# EAGLE design music-lights (EAGLE 9.6.1)
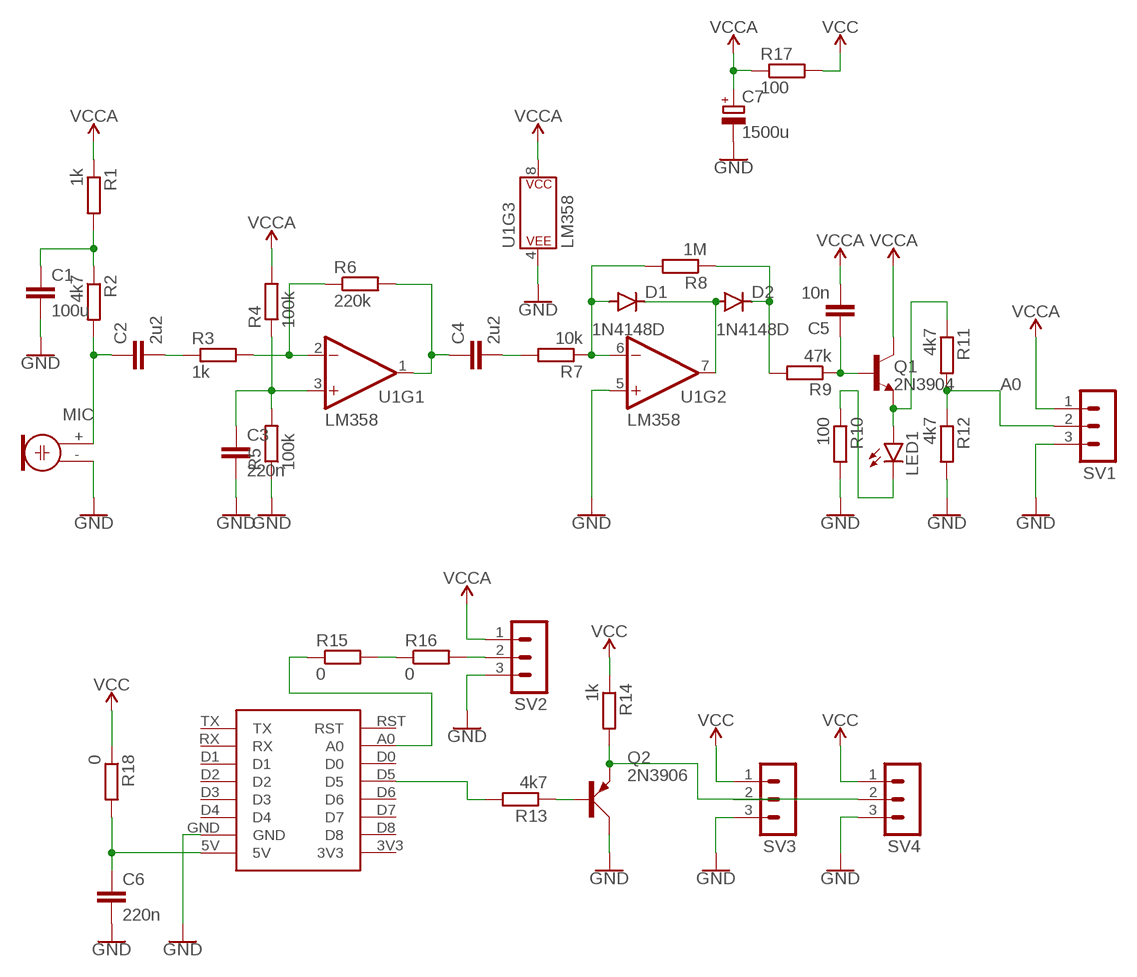
[diagram p0: schematic, sheet 1]

## Parts
C1  100u  C-EU050-024X044  [C050-024X044]
C2  2u2  C-EU050-024X044  [C050-024X044]
C3  220n  C-EU050-024X044  [C050-024X044]
C4  2u2  C-EU050-024X044  [C050-024X044]
C5  10n  C-EU050-024X044  [C050-024X044]
C6  220n  C-EU050-024X044  [C050-024X044]
C7  1500u  CPOL-EUTT5D7L  [TT5D7L]
D1  1N4148D  1N4148DO35-7  [DO35-7]
D2  1N4148D  1N4148DO35-7  [DO35-7]
LED1  LED5MM  [LED5MM]
MIC  ELECTRET  [9.7ELECTRET]
Q1  2N3904  [TO92]
Q2  2N3906  [TO92D]
R1  1k  R-EU_0207/7  [0207/7]
R2  4k7  R-EU_0207/7  [0207/7]
R3  1k  R-EU_0207/7  [0207/7]
R4  100k  R-EU_0207/7  [0207/7]
R5  100k  R-EU_0207/7  [0207/7]
R6  220k  R-EU_0207/7  [0207/7]
R7  10k  R-EU_0207/7  [0207/7]
R8  1M  R-EU_0207/7  [0207/7]
R9  47k  R-EU_0207/7  [0207/7]
R10  100  R-EU_0207/7  [0207/7]
R11  4k7  R-EU_0207/7  [0207/7]
R12  4k7  R-EU_0207/7  [0207/7]
R13  4k7  R-EU_0207/7  [0207/7]
R14  1k  R-EU_0207/7  [0207/7]
R15  0  R-EU_0207/7  [0207/7]
R16  0  R-EU_0207/7  [0207/7]
R17  100  R-EU_0207/7  [0207/7]
R18  0  R-EU_0207/7  [0207/7]
SV1  MA03-1  [MA03-1]
SV2  MA03-1  [MA03-1]
SV3  MA03-1  [MA03-1]
SV4  MA03-1  [MA03-1]
U1  LM358  LM358KIT  [DIP08-KIT]
U$1  8266MINI  [8266MINI]

## Nets
A0: R11.2 R12.1 SV1.2
GND: C1.2 C3.2 C6.2 C7.- MIC.- Q2.C R5.1 R10.2 R12.2 SV1.3 SV2.3 SV3.3 SV4.3 U1.4(P$V-) U1.5(+IN) U$1.GND
N$1: R13.2 U$1.D5
N$2: Q2.B R13.1
N$3: C2.1 MIC.+ R2.2
N$4: C1.1 R1.2 R2.1
N$5: C2.2 R3.1
N$6: C3.1 R4.1 R5.2 U1.3(+IN)
N$7: R3.2 R6.1 U1.2(-IN)
N$8: C4.1 R6.2 U1.1(OUT)
N$9: C4.2 R7.2
N$10: D1.C D2.A U1.7(OUT)
N$11: D1.A R7.1 R8.2 U1.6(-IN)
N$12: D2.C R8.1 R9.2
N$13: C5.1 Q1.2(B) R9.1
N$14: LED1.K(C) R10.1
N$15: LED1.A Q1.3(E) R11.1
N$16: Q2.E R14.2 SV3.2 SV4.2
N$17: R16.2 SV2.2
N$18: R15.1 U$1.A0
N$19: R15.2 R16.1
N$21: C6.1 R18.2 U$1.5V
VCC: R14.1 R17.2 R18.1 SV3.1 SV4.1
VCCA: C5.2 C7.+ Q1.1(C) R1.1 R4.2 R17.1 SV1.1 SV2.1 U1.8(P$V+)
Unconnected: U$1.3V3 U$1.D0 U$1.D1 U$1.D2 U$1.D3 U$1.D4 U$1.D6 U$1.D7 U$1.D8 U$1.RST U$1.RX U$1.TX

## Library data of the parts
C1-C6 = rcl:C-EU: CAPACITOR, European symbol; SPICEPREFIX: C
C7 = rcl:CPOL-EU: POLARIZED CAPACITOR, European symbol; SPICEPREFIX: C
D1 D2 = diode:1N4148: DIODE high speed (Philips)
LED1 = led:LED: LED OSRAM: - CHIPLED LG R971, LG N971, LY N971, LG Q971, LY Q971, LO R971, LY R971 LH N974, LH R974 LS Q976, LO Q976, LY Q976 LO Q996 - Hyper CHIPLED LW Q18S LB Q993, LB Q99A, LB R99A - SideLED LS A670, LO A670, LY A670, LG A670, LP A670 LB A673, LV A673, LT A673, LW A673 LH A674 LY A675 LS A676, LA A676, LO A676, LY A676, LW A676 LS A679, LY A679, LG A679 - Hyper Micro SIDELED® LS Y876, LA Y876, LO Y876, LY Y876 LT Y87S - SmartLED LW L88C, LW L88S LB L89C, LB L89S, LG L890 LS L89K, LO L89K, LY L89K LS L896, LA L896, LO L896, LY L896 - TOPLED LS T670, LO T670, LY T670, LG T670, LP T670 LSG T670, LSP T670, LSY T670, LOP T670, LYG T670 LG T671, LOG T671, LSG T671 LB T673, LV T673, LT T673, LW T673 LH T674 LS T676, LA T676, LO T676, LY T676, LB T676, LH T676, LSB T676, LW T676 LB T67C, LV T67C, LT T67C, LS T67K, LO T67K, LY T67K, LW E67C LS E67B, LA E67B, LO E67B, LY E67B, LB E67C, LV E67C, LT E67C LW T67C LS T679, LY T679, LG T679 LS T770, LO T770, LY T770, LG T770, LP T770 LB T773, LV T773, LT T773, LW T773 LH T774 LS E675, LA E675, LY E675, LS T675 LS T776, LA T776, LO T776, LY T776, LB T776 LHGB T686 LT T68C, LB T68C - Hyper Mini TOPLED® LB M676 - Mini TOPLED Santana® LG M470 LS M47K, LO M47K, LY M47K Source: http://www.osram.convergy.de LUXEON: - LUMILED® LXK2-PW12-R00, LXK2-PW12-S00, LXK2-PW14-U00, LXK2-PW14-V00 LXK2-PM12-R00, LXK2-PM12-S00, LXK2-PM14-U00 LXK2-PE12-Q00, LXK2-PE12-R00, LXK2-PE12-S00, LXK2-PE14-T00, LXK2-PE14-U00 LXK2-PB12-K00, LXK2-PB12-L00, LXK2-PB12-M00, LXK2-PB14-N00, LXK2-PB14-P00, LXK2-PB14-Q00 LXK2-PR12-L00, LXK2-PR12-M00, LXK2-PR14-Q00, LXK2-PR14-R00 LXK2-PD12-Q00, LXK2-PD12-R00, LXK2-PD12-S00 LXK2-PH12-R00, LXK2-PH12-S00 LXK2-PL12-P00, LXK2-PL12-Q00, LXK2-PL12-R00 Source: www.luxeon.com KINGBRIGHT: KA-3528ASYC Source: www.kingbright.com
MIC = adafruit:ELECTRET: Electret microphone Thru hole 2.54mm spacing with 9.7mm diameter
Q1 = transistor:2N3904: NPN TRANSISTOR
Q2 = transistor-small-signal:2N3906: PNP TRANSISTOR
R1-R18 = rcl:R-EU_: RESISTOR, European symbol; SPICEPREFIX: R
SV1-SV4 = con-lstb:MA03-1: PIN HEADER; OC_FARNELL: unknown; OC_NEWARK: unknown
U1 = SparkFun-IC-Amplifiers:LM358: LM358 Jellybean op-amp Datasheet <http://www.sparkfun.com/datasheets/Components/General/LM358.pdf> SparkFun Products Op-Amp (Thru-Hole) - LM358 <https://www.sparkfun.com/products/9456> (COM-09456); PROD_ID: IC-09172
U$1 = chinese-modules:8266MINI: ESP8266 WeMos D1 Mini

## Board
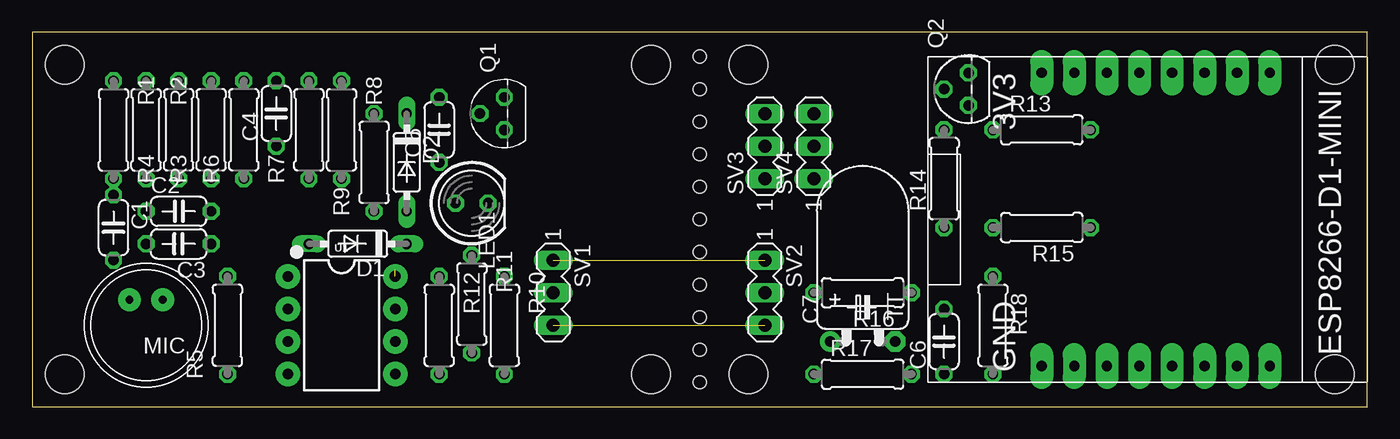
[diagram p1: board, top side]
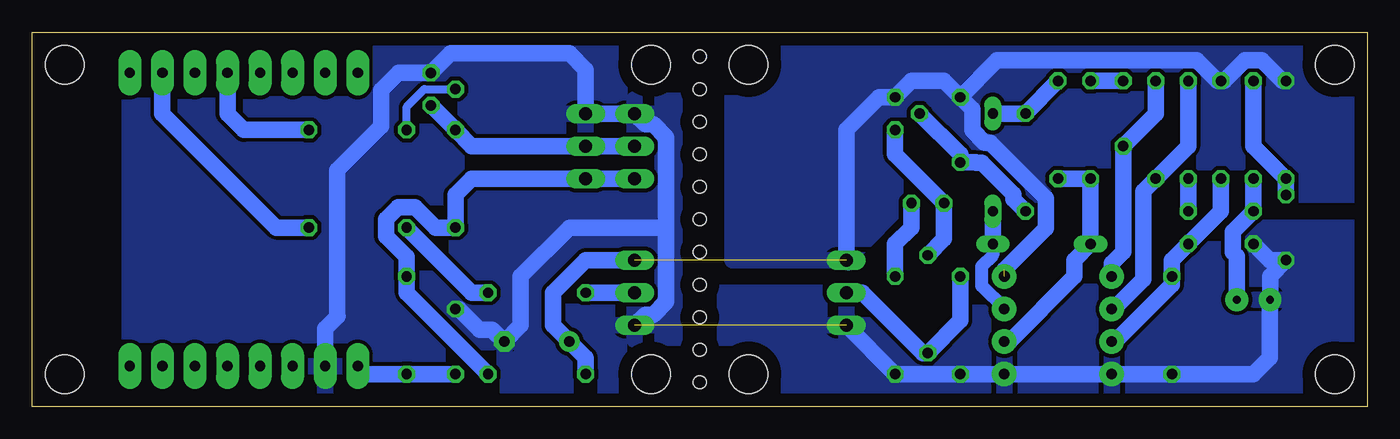
[diagram p2: board, bottom side, seen from below]

Size 104.14 x 29.21 mm. Coordinates in mm from the lower left corner, seen from the top.
Outline: 0,0 104.14,0 104.14,29.21 0,29.21 0,0
Copper layers (1*16): Top 0.035mm / dielectric 1.5mm / Bottom 0.035mm
Design rules "default *": minimum track width 6mil, minimum drill 0.35mm, track to track 12mil, track to pad 12mil, pad to pad 12mil, via to via 12mil, smd to smd 12mil, copper to edge 40mil, drill to drill 6mil, minimum pad ring 10mil, minimum via ring 8mil, stop-mask expansion 4mil, vias tented up to drill 0mil, thermal gap 10mil
Holes 3 mm at 48.26,2.54 48.26,26.67 2.54,26.67 2.54,2.54 101.6,2.54 55.88,2.54 55.88,26.67 101.6,26.67
Holes 1 mm at 52.07,27.3 52.07,24.77 52.07,22.23 52.07,19.68 52.07,17.14 52.07,14.61 52.07,12.06 52.07,9.53 52.07,6.99 52.07,4.45 52.07,1.91

### Footprints (pad centres in the part's own frame; a part is rotated, then mirrored left to right if it is on the bottom)
C050-024X044 = drill 0.813 octagon: 1 -2.54,0; 2 2.54,0
TT5D7L = drill 0.813 pad 1.6: + -2.54,0 | drill 0.813 pad 1.6 octagon: - 2.54,0
DO35-7 = drill 0.813 long: A 3.81,0; C -3.81,0
LED5MM = drill 0.813 octagon: A -1.27,0; K 1.27,0
9.7ELECTRET = drill 0.6 pad 1.778: + 1.3,2; - -1.3,2
TO92 = drill 0.813 octagon: 1 1.27,0; 2 0,1.905; 3 -1.27,0
TO92D = drill 0.813 octagon: B 0,1.905; C 1.27,0; E -1.27,0
0207/7 = drill 0.813 octagon: 1 -3.81,0; 2 3.81,0
MA03-1 = drill 1.016 long: 1 -2.54,0; 2 0,0; 3 2.54,0
DIP08-KIT = drill 0.813 pad 1.905: 1 -3.81,-4.191; 2 -1.27,-4.191; 3 1.27,-4.191; 4 3.81,-4.191; 5 3.81,4.191; 6 1.27,4.191; 7 -1.27,4.191 | drill 0.864 pad 1.905: 8 -3.81,4.191
8266MINI = drill 0.8 pad 1.778 long: 3V3 1.27,8.89; 5V 24.13,8.89; A0 1.27,24.13; D0 1.27,21.59; D1 24.13,21.59; D2 24.13,19.05; D3 24.13,16.51; D4 24.13,13.97; D5 1.27,19.05; D6 1.27,16.51; D7 1.27,13.97; D8 1.27,11.43; GND 24.13,11.43; RST 1.27,26.67; RX 24.13,24.13; TX 24.13,26.67

### Placement (x,y rotation side)
C1  6.35,13.97 270 top
C2  11.43,15.24 0 top
C3  11.43,12.7 180 top
C4  19.05,22.86 90 top
C5  31.75,21.59 90 top
C6  71.12,5.08 90 top
C7  64.77,5.08 0 top
D1  25.4,12.7 180 top
D2  29.21,19.05 270 top
LED1  34.29,15.88 0 top
MIC  8.89,6.35 0 top
Q1  36.83,22.86 90 top
Q2  73.03,24.77 90 top
R1  6.35,21.59 270 top
R2  8.89,21.59 270 top
R3  13.97,21.59 90 top
R4  11.43,21.59 90 top
R5  15.24,6.35 90 top
R6  16.51,21.59 90 top
R7  21.59,21.59 90 top
R8  24.13,21.59 270 top
R9  26.67,19.05 90 top
R10  36.83,6.35 270 top
R11  34.29,8 270 top
R12  31.75,6.35 270 top
R13  78.74,21.59 0 top
R14  71.12,17.78 90 top
R15  78.74,13.97 180 top
R16  64.77,8.89 180 top
R17  64.77,2.54 0 top
R18  74.93,6.35 270 top
SV1  40.64,8.89 270 top
SV2  57.15,8.89 270 top
SV3  57.15,20.32 90 top
SV4  60.96,20.32 90 top
U1  24.13,6.35 270 top
U$1  69.85,27.3 270 top

### Tracks (layer width: path | path; a pad name or v marks a point on that pad's centre or on a via)
A0
  Bottom 1.27: SV1.2 39.37,8.89 34.67,4.19 R11.2 31.75,6.73 R12.1
GND  (1 unrouted)
  Bottom 1.27: C3.2 7.62,11.43 C1.2 7.59,10.19 MIC.- 7.62,8.32 7.62,3.81 8.89,2.54 R5.1 U1.4 U1.5 R12.2 R10.2 SV1.3 | SV2.3 56.31,7.19 55.68,7.19 54.69,8.19 54.69,13.97 | 54.69,13.97 54.69,21.02 55.68,22.02 56.31,22.02 SV3.3 SV4.3 60.96,26.29 62.23,27.56 71.5,27.56 Q2.C 75.56,26.04 76.91,24.69 76.91,21.87 80.34,18.44 80.34,7.06 80.31,7.04 81.28,6.07 U$1.GND | 54.69,13.97 62.23,13.97 66.04,10.16 66.04,6.35 C7.- 68.25,6.02 69.24,6.02 70.84,7.62 C6.2
  pour Bottom: 0,13.97 34.29,13.97 39.37,8.89 52.07,8.89 52.07,29.21 96.52,29.21 96.52,0 0,0
N$1
  Bottom 1.27: R13.2 87.63,21.59 88.9,22.86 U$1.D5
N$2
  Bottom 0.61: Q2.B 73.55,24.77 74.93,23.39 R13.1
N$3
  Bottom 1.27: R2.2 C2.1 10.49,13.64 10.49,12.04 10.19,11.74 MIC.+
N$4
  Bottom 1.27: C1.1 R1.2 8.89,20.32 R2.1
N$5
  Bottom 1.27: C2.2 R3.1
N$6
  Bottom 1.27: R4.1 11.43,15.24 C3.1 15.24,11.43 R5.2 15.24,9.53 19.68,5.08 U1.3
N$7
  Bottom 1.27: R3.2 13.97,20.32 R6.1 17.48,16.82 17.48,9.95 19.8,7.62 U1.2
N$8
  Bottom 1.27: U1.1 19.94,11.18 19.05,12.06 C4.1 16.51,22.86 R6.2
N$9
  Bottom 1.27: C4.2 R7.2
N$10
  Bottom 1.016: D1.C 29.21,11.82 30.09,10.95 30.09,9.43 28.32,7.66 U1.7
  Bottom 1.27: D2.A D1.C
N$11
  Bottom 1.27: R8.2 R7.1 D1.A 22.86,11.43 22.86,10.16 27.94,5.08 U1.6
N$12
  Bottom 1.27: R8.1 R9.2 D2.C
N$13
  Bottom 1.27: R9.1 27.61,16.18 27.61,16.56 30.07,19.02 30.52,19.02 30.55,19.05 C5.1 31.75,19.68 Q1.2
N$14
  Bottom 1.27: R10.1 36.83,12.7 35.56,13.97 LED1.K
N$15
  Bottom 1.27: R11.1 33.02,13.08 LED1.A 36.83,19.68 Q1.3
N$16
  Bottom 1.27: SV3.2 SV4.2 69.85,20.32 R14.2 Q2.E
N$17
  Bottom 1.27: SV2.2 R16.2
N$18
  Bottom 1.27: U$1.A0 93.98,22.86 85.09,13.97 R15.1
N$19
  Bottom 1.27: R15.2 69.85,8.89 R16.1
N$21
  Bottom 1.27: C6.1 R18.2 78.11,2.54 U$1.5V
VCC
  Bottom 1.27: SV3.1 SV4.1 69.85,17.78 71.12,16.51 R14.1 72.67,13.97 74.27,15.57 75.59,15.57 76.53,14.63 76.53,13.31 74.93,11.71 R18.1 74.93,8.89 R17.2
VCCA  (2 unrouted)
  Bottom 1.27: R4.2 11.15,25.4 9.55,27 8.23,27 6.63,25.4 | 11.71,25.4 13.31,27 28.88,27 C5.2 | C5.2 30.81,23.19 30.81,21.54 29.87,20.6 29.42,20.6 25.07,16.25 25.07,13.92 28.32,10.67 | C5.2 33.02,25.4 35.56,25.4 Q1.1 38.1,24.13 40.64,21.59 SV1.1 40.46,11.25 | R17.1 60.96,3.81 C7.+ 63.5,6.35 63.5,8.89 60.96,11.43 SV2.1
  pour Bottom: 0,29.21 0,16.51 35.56,16.51 40.64,11.43 49.53,11.43 49.53,29.21

### Text on the board
tValues: +5V | LED | GND | VCCA | ADC | GND | GND